# EAGLE design luminet_adapter (EAGLE 6.3)
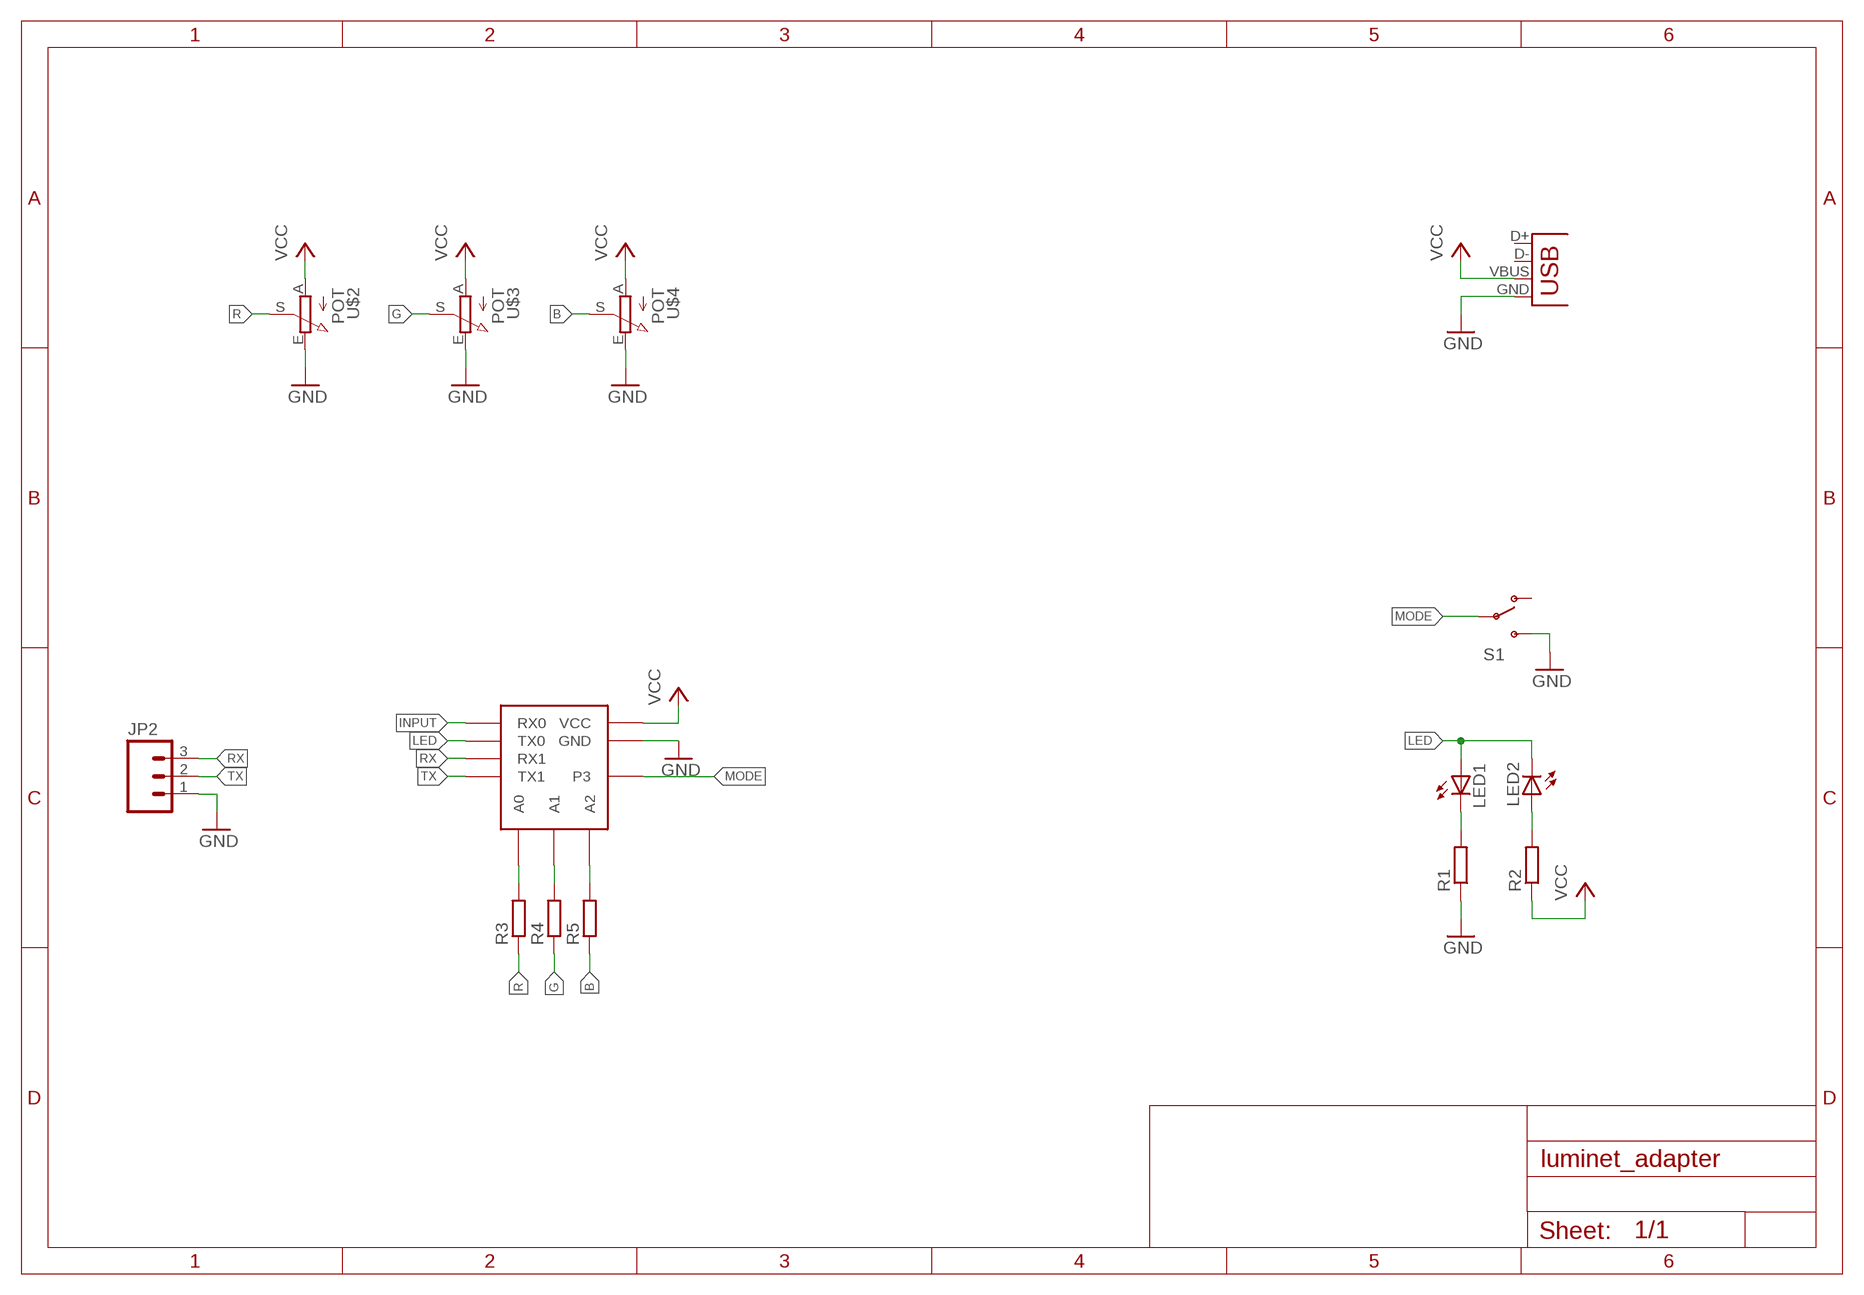
[diagram p0: schematic, sheet 1]

## Parts
JP1  USBOLD  [USB-MINIB-OLD]
JP2  M03LOCK_LONGPADS  [1X03_LOCK_LONGPADS]
LED1  LEDCHIPLED_1206  [CHIPLED_1206]
LED2  LEDCHIPLED_1206  [CHIPLED_1206]
R1  R-EU_R0805  [R0805]
R2  R-EU_R0805  [R0805]
R3  R-EU_R0805  [R0805]
R4  R-EU_R0805  [R0805]
R5  R-EU_R0805  [R0805]
S1  SWITCH-SPDT-SMD-A  [SWITCH-SPST-SMD-A]
U$1  LUMINET2  [LUMINET_ADAPTER]
U$2  POT  [POTENTIOMETER]
U$3  POT  [POTENTIOMETER]
U$4  POT  [POTENTIOMETER]

## Nets
B: R5.1 U$4.S
B1: R5.2 U$1.A2
G: R4.1 U$3.S
G1: R4.2 U$1.A1
GND: JP1.GND JP2.1 R1.1 S1.3(S) U$1.GND@1(GND) U$1.GND@2(GND) U$1.GND@3(GND) U$2.E U$3.E U$4.E
INPUT: U$1.RX0
LED: LED1.A LED2.C U$1.TX0
MODE: S1.2(P) U$1.P3
N$1: LED1.C R1.2
N$2: LED2.A R2.2
R: R3.1 U$2.S
R1: R3.2 U$1.A0
RX: JP2.3 U$1.RX1
TX: JP2.2 U$1.TX1
VCC: JP1.VBUS R2.1 U$1.VCC@1(VCC) U$1.VCC@2(VCC) U$1.VCC@3(VCC) U$2.A U$3.A U$4.A
Unconnected: JP1.D+ JP1.D- S1.1(O)

## Library data of the parts
JP1 = SparkFun-Connectors:USB: USB Connectors USB-B-PTH is fully proven SKU : PRT-00139/CONN-08278 USB-miniB is fully proven SKU : PRT-00587 USB-A-PCB is untested. USB-A-H is throughly reviewed, but untested. Spark Fun Electronics SKU : PRT-00437 USB-B-SMT is throughly reviewed, but untested. Needs silkscreen touching up. USB-A-S has not been used/tested USB-MB-H has not been used/tested USB-MICROB has been used. CONN-09505
JP2 = SparkFun-Connectors:M03: Header 3 Standard 3-pin 0.1" header. Use with straight break away headers (SKU : PRT-00116), right angle break away headers (PRT-00553), swiss pins (PRT-00743), machine pins (PRT-00117), and female headers (PRT-00115). Molex polarized connector foot print use with SKU : PRT-08232 with associated crimp pins and housings.
LED1 LED2 = led:LED: LED OSRAM: - CHIPLED LG R971, LG N971, LY N971, LG Q971, LY Q971, LO R971, LY R971 LH N974, LH R974 LS Q976, LO Q976, LY Q976 LO Q996 - Hyper CHIPLED LW Q18S LB Q993, LB Q99A, LB R99A - SideLED LS A670, LO A670, LY A670, LG A670, LP A670 LB A673, LV A673, LT A673, LW A673 LH A674 LY A675 LS A676, LA A676, LO A676, LY A676, LW A676 LS A679, LY A679, LG A679 - Hyper Micro SIDELED® LS Y876, LA Y876, LO Y876, LY Y876 LT Y87S - SmartLED LW L88C, LW L88S LB L89C, LB L89S, LG L890 LS L89K, LO L89K, LY L89K LS L896, LA L896, LO L896, LY L896 - TOPLED LS T670, LO T670, LY T670, LG T670, LP T670 LSG T670, LSP T670, LSY T670, LOP T670, LYG T670 LG T671, LOG T671, LSG T671 LB T673, LV T673, LT T673, LW T673 LH T674 LS T676, LA T676, LO T676, LY T676, LB T676, LH T676, LSB T676, LW T676 LB T67C, LV T67C, LT T67C, LS T67K, LO T67K, LY T67K, LW E67C LS E67B, LA E67B, LO E67B, LY E67B, LB E67C, LV E67C, LT E67C LW T67C LS T679, LY T679, LG T679 LS T770, LO T770, LY T770, LG T770, LP T770 LB T773, LV T773, LT T773, LW T773 LH T774 LS E675, LA E675, LY E675, LS T675 LS T776, LA T776, LO T776, LY T776, LB T776 LHGB T686 LT T68C, LB T68C - Hyper Mini TOPLED® LB M676 - Mini TOPLED Santana® LG M470 LS M47K, LO M47K, LY M47K Source: http://www.osram.convergy.de LUXEON: - LUMILED® LXK2-PW12-R00, LXK2-PW12-S00, LXK2-PW14-U00, LXK2-PW14-V00 LXK2-PM12-R00, LXK2-PM12-S00, LXK2-PM14-U00 LXK2-PE12-Q00, LXK2-PE12-R00, LXK2-PE12-S00, LXK2-PE14-T00, LXK2-PE14-U00 LXK2-PB12-K00, LXK2-PB12-L00, LXK2-PB12-M00, LXK2-PB14-N00, LXK2-PB14-P00, LXK2-PB14-Q00 LXK2-PR12-L00, LXK2-PR12-M00, LXK2-PR14-Q00, LXK2-PR14-R00 LXK2-PD12-Q00, LXK2-PD12-R00, LXK2-PD12-S00 LXK2-PH12-R00, LXK2-PH12-S00 LXK2-PL12-P00, LXK2-PL12-Q00, LXK2-PL12-R00 Source: www.luxeon.com KINGBRIGHT: KA-3528ASYC Source: www.kingbright.com
R1-R5 = rcl:R-EU_: RESISTOR, European symbol
S1 = SparkFun-Electromechanical:SWITCH-SPDT: SPDT Switch Simple slide switch, Spark Fun Electronics SKU : COM-00102 DPDT SMT slide switch, AYZ0202, SWCH-08179
U$1 = hauser:LUMINET2
U$2-U$4 = hauser:POT

## Board
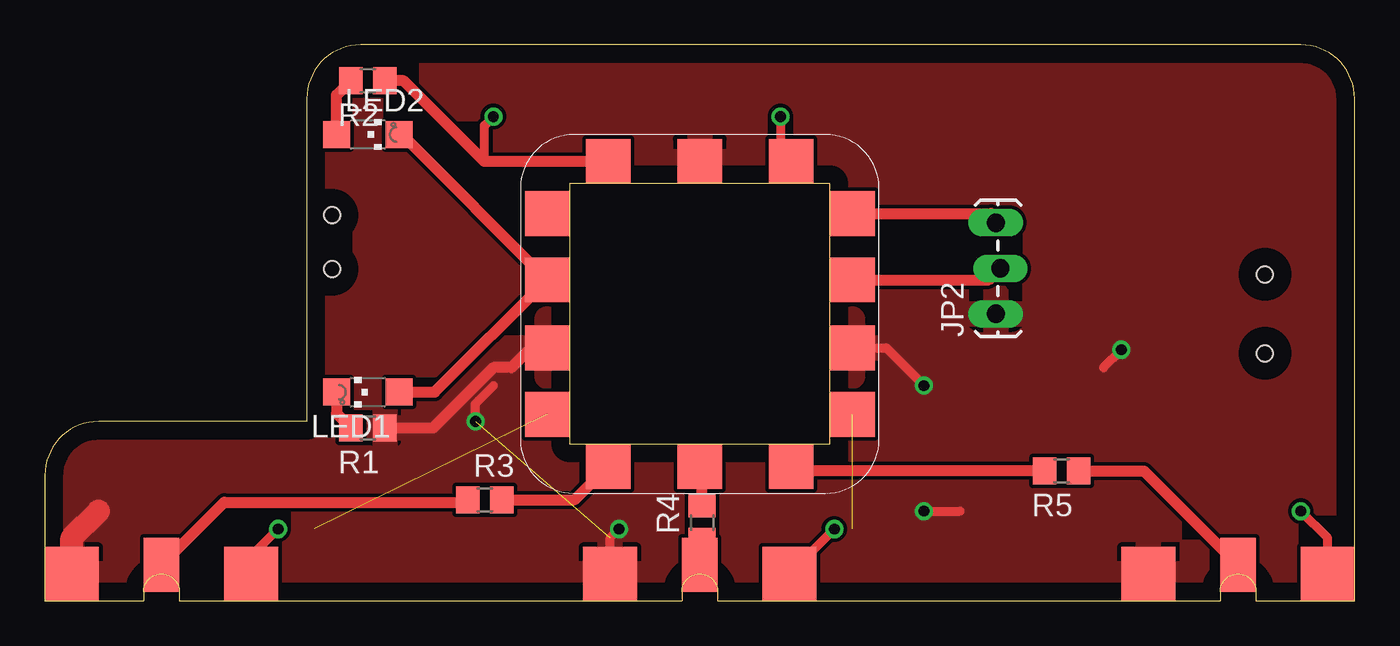
[diagram p1: board, top side]
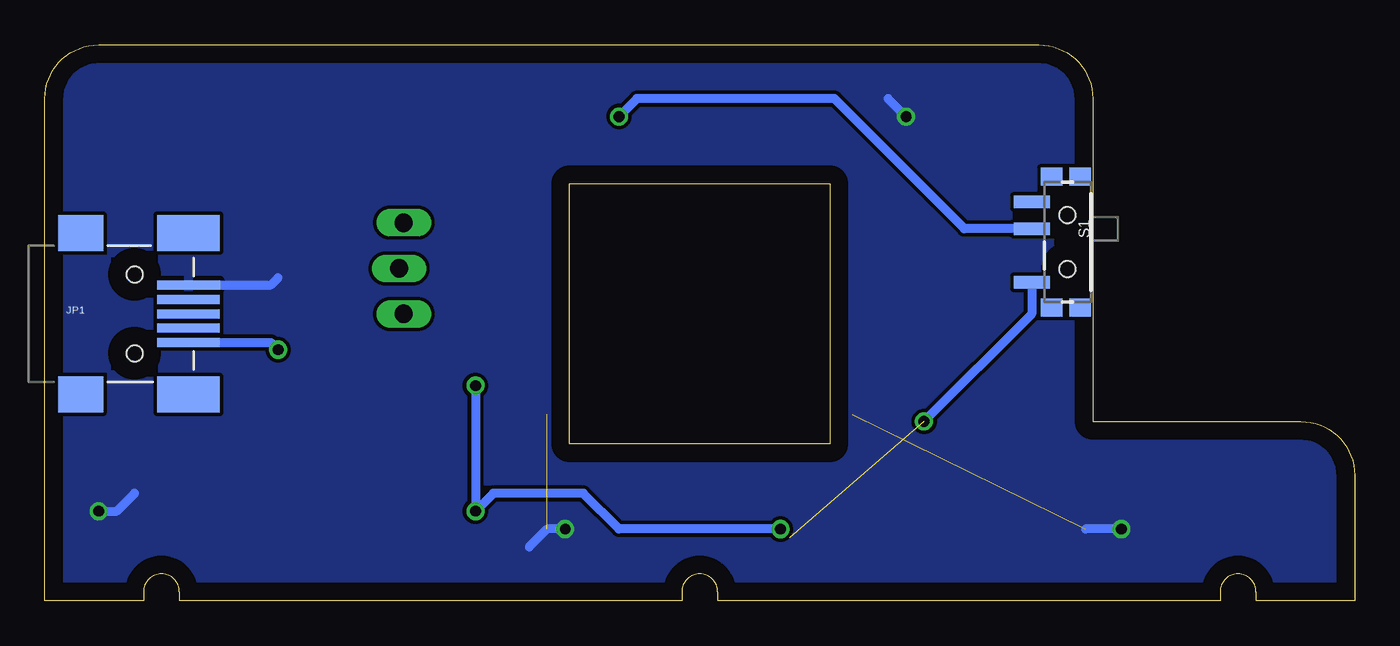
[diagram p2: board, bottom side, seen from below]

Size 73 x 31 mm. Coordinates in mm from the lower left corner, seen from the top.
Outline: 5.5,0 0,0 0,7 arc-90 3,10 14.6,10 14.6,28 arc-90 17.6,31 70,31 arc-90 73,28 73,0 67.5,0
Outline: 7.5,0 35.5,0
Outline: 37.5,0 65.5,0
Copper layers (1*16): Top 0.035mm / dielectric 1.5mm / Bottom 0.035mm
Design rules "default *": minimum track width 10mil, minimum drill 24mil, track to track 8mil, track to pad 30mil, pad to pad 8mil, via to via 8mil, smd to smd 8mil, copper to edge 40mil, drill to drill 8mil, minimum pad ring 10mil, minimum via ring 8mil, stop-mask expansion 4mil, vias tented up to drill 0mil, thermal gap 10mil

### Footprints (pad centres in the part's own frame; a part is rotated, then mirrored left to right if it is on the bottom)
USB-MINIB-OLD = smd 2.5 x 2: 1 -3,-4.5; 2 -3,4.5 | smd 3.5 x 2: 3 3,-4.5; 4 3,4.5 | smd 3.5 x 0.5: D+ 3,0; D- 3,0.8; GND 3,-1.6; ID 3,-0.8; VBUS 3.01,1.61 | hole 0.9: 0,2.2; 0,-2.2
1X03_LOCK_LONGPADS = drill 1.016 long: 1 0,0; 2 2.54,-0.254; 3 5.08,0
CHIPLED_1206 = smd 1.5 x 1.5: A 0,-1.75; C 0,1.75
R0805 = smd 1.3 x 1.5: 1 -0.95,0; 2 0.95,0
SWITCH-SPST-SMD-A = smd 0.7 x 2: 1 -2.25,-2; 2 -0.75,-2; 3 2.25,-2 | smd 1 x 1.2: GND1 -3.65,0.7; GND2 -3.65,-0.9; GND3 3.65,0.7; GND4 3.65,-0.9 | hole 0.9: -1.5,0; 1.5,0
LUMINET_ADAPTER = smd 2.5 x 2.5: A0 -5.1,-8.5; A1 0,-8.5; A2 5.1,-8.5; GND@1 -8.5,-1.9; GND@2 8.5,-1.9; GND@3 0,8.5; P3 5.1,8.5; RX0 -8.5,5.6; RX1 8.5,5.6; TX0 -8.5,1.9; TX1 8.5,1.9; VCC@1 -8.5,-5.6; VCC@2 8.5,-5.6; VCC@3 -5.1,8.5
POTENTIOMETER = smd 3 x 3: A 5,9; E -5,9 | smd 2 x 3: S 0,9.5

### Placement (x,y rotation side)
JP1  68,16 0 bottom
JP2  53,16 90 top
LED1  18,11.63 90 top
LED2  18,26 270 top
R1  18,9.63 180 top
R2  18,29 180 top
R3  24.52,5.63 0 top
R4  36.63,4.37 90 top
R5  56.66,7.24 180 top
S1  16,20 270 bottom
U$1  36.5,16 0 top
U$2  6.5,-7.5 0 top
U$3  36.5,-7.5 0 top
U$4  66.5,-7.5 0 top

### Tracks (layer width: path | path; a pad name or v marks a point on that pad's centre or on a via)
B
  Top 0.61: U$4.S 61.63,6.87 61.26,7.24 R5.1
B1
  Top 0.61: R5.2 41.86,7.24 U$1.A2
G
  Top 0.61: R4.1 36.63,2.13 U$3.S
G1
  Top 0.61: R4.2 36.63,7.37 U$1.A1
GND  (via drill 0.6)  (1 unrouted)
  Top 0.5: U$3.E 31.5,3.5 v32,4 | v49,5 51,5 | U$1.GND@2 46.9,14.1 v49,12 | v60,14 59,13 | v24,10 24,11 25,12
  Top 0.61: R1.1 21.64,9.63 22,10 25,13 26,13 27.1,14.1 U$1.GND@1
  Top 1.27: U$2.E 1.5,3.5 3,5
  Bottom 0.5: v32,4 41,4 43,6 48,6 v49,5 v49,12 | JP1.GND 60.4,14.4 v60,14 | S1.3 18,16 v24,10
  pour Top: 0,0 73,0 73,31 0,31
LED
  Top 0.61: LED1.A 21.73,11.63 U$1.TX0 19.9,26 LED2.C
MODE  (via drill 0.6)
  Top 0.5: v41,27 41,25.1 U$1.P3
  Bottom 0.5: S1.2 21.75,20.75 29,28 40,28 v41,27
N$1
  Top 0.61: LED1.C 16.25,10.44 R1.2
N$2
  Top 0.61: LED2.A 16.25,28.2 R2.2
R
  Top 0.61: U$2.S 10,5.5 23.57,5.5 R3.1
R1
  Top 0.61: R3.2 29.54,5.63 U$1.A0
RX
  Top 0.61: U$1.RX1 52.75,21.6 53,21.35 JP2.3
TX
  Top 0.61: U$1.TX1 52.44,17.9 52.61,17.9 JP2.2
VCC  (via drill 0.6)  (2 unrouted)
  Top 0.5: 24.5,24.5 24.5,26.5 v25,27 | U$2.A 11.5,2.5 v13,4 | U$3.A v44,4 | U$4.A 71.5,3.5 v70,5
  Top 0.61: U$1.VCC@3 24.5,24.5 20,29 R2.1
  Bottom 0.5: JP1.VBUS 60.39,17.61 60,18 | v25,27 26,28 | v13,4 15,4 | v44,4 45,4 46,3 | v70,5 69,5 68,6
  pour Bottom: 0,0 0,31 73,31 73,0